# Altium schematic sheet ATmega324PB_Xplained_Pro_dual_input_power_supply.SchDoc: Power supply
size A3; Organization: ATMEL Norway; Address1: Vestre Rosten 79; Address2: N-7075 TILLER; Address3: NORWAY; DocumentNumber: A09-2419; Revision: 2; SheetNumber: 2; SheetTotal: 5; PageSetup: Record=PageOptions|CenterHorizontal=True|CenterVertical=True|PrintScale=1.01|XCorrection=1.00|YCorrection=1.00|PrintKind=1|BorderSize=5000000|LeftOffset=0|BottomOffset=0|Orientation=2|PaperLength=1000|PaperWidth=1000|Scale=100|PaperSource=7|PrintQuality=-4|MediaType=1|DitherType=10|PaperKind=A3 (297 x 420 mm)|PrintScaleMode=1
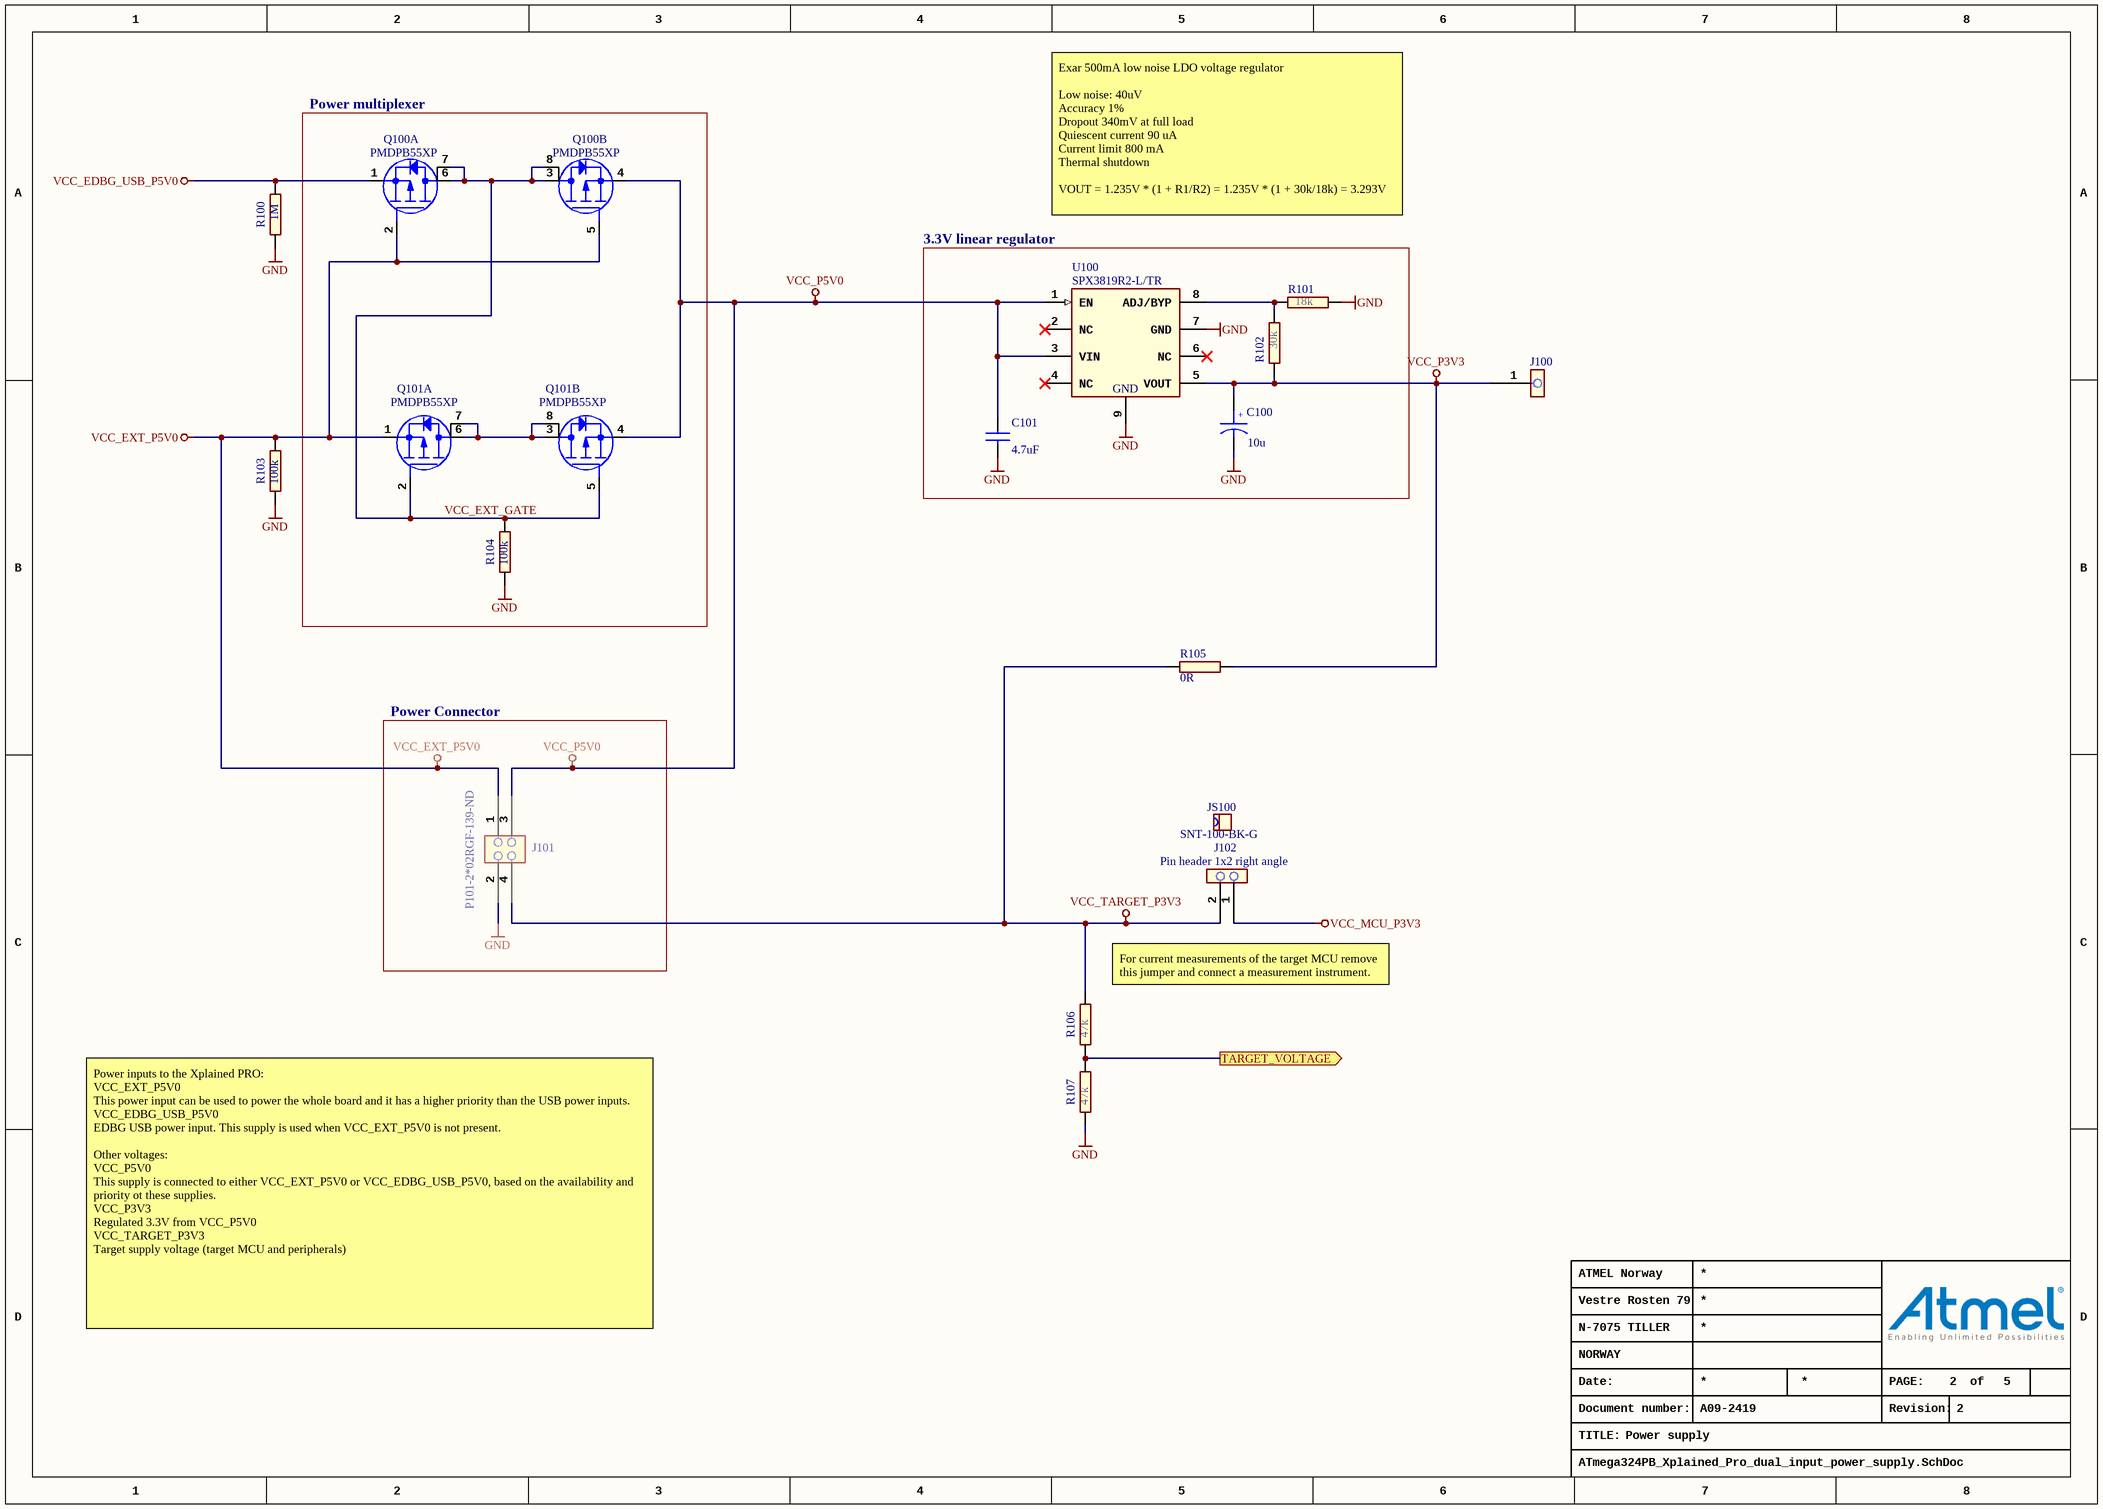
[diagram p0: ATmega324PB_Xplained_Pro_dual_input_power_supply.SchDoc]

## Parts
C100  value 10u  [AP1-00036]
C101  value 4.7uF  [AP1-00039]
J100  (no value)  [AP8-00976]
J101  value P101-2*02RGF-139-ND  [AP8-00628]
J102  value Pin header 1x2 right angle  [AP8-00367]
JS100  value SNT-100-BK-G  [AP8-00525]
Q100  value PMDPB55XP  [AP5-00047]  (hidden comment: Farnell order code: 2191806)  (parts A,B of 2)
Q101  value PMDPB55XP  [AP5-00047]  (hidden comment: Farnell order code: 2191806)  (parts A,B of 2)
R100  value 1M  [AP2-00000]
R101  value 18k  [AP2-00000]
R102  value 30k  [AP2-00000]
R103  value 100k  [AP2-00000]
R104  value 100k  [AP2-00000]
R105  value 0R  [AP2-00000]
R106  value 47k  [AP2-00000]
R107  value 47k  [AP2-00000]
U100  value SPX3819R2-L/TR  [AP6-00338]  (hidden comment: DigiKey: 1016-1588-2-ND)

## Blocks framed on the sheet
Power multiplexer: Q100 Q101 R104
3.3V linear regulator: C100 C101 R101 R102 U100
Power Connector: J101

## Ports
TARGET_VOLTAGE (out)

## Nets
GND: C100.2 C101.2 J101.2 R100.1 R101.2 R103.1 R104.1 R107.1 U100.7(GND) U100.9(GND)
VCC_EDBG_USB_P5V0: Q100.1(S1) R100.2
VCC_EXT_P5V0: J101.1 Q100.2(G1) Q100.5(G2) Q101.1(S1) R103.2
VCC_MCU_P3V3: J102.1
VCC_P3V3: C100.1 J100.1 R102.1 R105.2 U100.5(VOUT)
VCC_P5V0: C101.1 J101.3 Q100.4(S2) Q101.4(S2) U100.1(EN) U100.3(VIN)
VCC_TARGET_P3V3: J101.4 J102.2 R105.1 R106.2
TARGET_VOLTAGE: R106.1 R107.2 ; port TARGET_VOLTAGE
VCC_EXT_GATE: Q100.3(D2) Q100.6(D1) Q100.7(D1_PAD) Q100.8(D2_PAD) Q101.2(G1) Q101.5(G2) R104.2
NetQ101_3: Q101.3(D2) Q101.6(D1) Q101.7(D1_PAD) Q101.8(D2_PAD)
NetR101_1: R101.1 R102.2 U100.8(ADJ/BYP)

Not connected (* = marked no-connect by the designer): U100 2(NC)* 4(NC)* 6(NC)*

## Notes on the sheet
- Exar 500mA low noise LDO voltage regulator
  Low noise: 40uV
  Accuracy 1%
  Dropout 340mV at full load
  Quiescent current 90 uA
  Current limit 800 mA
  Thermal shutdown
  VOUT = 1.235V * (1 + R1/R2) = 1.235V * (1 + 30k/18k) = 3.293V
- (near R106) For current measurements of the target MCU remove this jumper and connect a measurement instrument.
- Power inputs to the Xplained PRO:
  VCC_EXT_P5V0
  This power input can be used to power the whole board and it has a higher priority than the USB power inputs.
  VCC_EDBG_USB_P5V0
  EDBG USB power input. This supply is used when VCC_EXT_P5V0 is not present.
  Other voltages:
  VCC_P5V0
  This supply is connected to either VCC_EXT_P5V0 or VCC_EDBG_USB_P5V0, based on the availability and priority ot these supplies.
  VCC_P3V3
  Regulated 3.3V from VCC_P5V0
  VCC_TARGET_P3V3
  Target supply voltage (target MCU and peripherals)
- Date:
- PAGE:
- of
- TITLE:
- Document number:
- Revision:
- (in symbol A01-0324) +

## Library data of the parts
C100 = A01-0324: SMD tantalum capacitor, ESR = 1.7, 3216-18 (EIA) 1206,; PartGroup: Capacitors,Tantalum; Manufacturer: vishay; MPN: TR3A106K016C1700; Tolerance: +-10%; TemperatureRange: -55°C ~ 85°C; AN: A01-0324; Height: 1,60000002384186
C101 = A01-0377: Ceramic capacitor, SMD 0603, X5R, 10V, 10% (de31036); PartGroup: Capacitors,Ceramic,SMD 0603; Manufacturer: tdk; MPN: C1608X5R1A475K; TemperatureRange: -55 - +85 deg C; AN: A01-0377; Tolerance: 10%; Height: 0,800000011920929
J100 = A08-2457: 1x1 pin header, 2.54mm pitch, Pin-in-Paste THM; PartGroup: Mechanical devices,Connectors,Pin headers; Manufacturer: SAMTEC; Value: HMTSW-101-23-F-S-237; TemperatureRange: - 55 deg C to + 125 deg C; AN: A08-2457; Height: 6,09999990463257; MPN: HMTSW-101-23-F-S-237
J101 = A08-1519: Pin header, 2x2, Right Angle, 2.54mm, THT, Pin In Paste; PartGroup: Mechanical devices,Connectors,Pin headers; Manufacturer: Pro-data International Corp; AN: A08-1519; Height: 5,07999992370605; MPN: P101-2*02RGF-139-ND
J102 = A08-0764: 1x2 pin header, right angle, 2.54 mm pitch, through-hole; PartGroup: Mechanical devices,Connectors,Pin headers; Manufacturer: Pro-data International Corp; MPN: 2213R-2G; AN: A08-0764; Height: 2,53999996185303
JS100 = A08-0543: Jumper cap for 2.54mm pinheader; PartGroup: Mechanical devices,Mounting accessories,Other; Manufacturer: SAMTEC; AN: A08-0543; MPN: SNT-100-BK-G
Q100 Q101 = A05-0146: Dual P-Channel MOSFET, -20V, RDS(ON) < 55 mOhm @-3.4A@-4.5V; PartGroup: Transistors,Power FET,SMD; Manufacturer: NXP; TemperatureRange: -55Â°C to 150Â°C; AN: A05-0146; Height: 0,649999976158142; MPN: PMDPB55XP
R100 = A02-0284: Thick film resistor, SMD 0402, 1/16W, 1%; PartGroup: Resistors,SMD,0402 1%; TemperatureRange: -55 - +125 deg C; AN: A02-0284; Tolerance: 1 %; Height: 0,349999994039536
R101 = A02-0242: Thick film resistor, SMD 0402, 1/16W, 1%; PartGroup: Resistors,SMD,0402 1%; TemperatureRange: -55ï¿½ to +155ï¿½C; AN: A02-0242; Tolerance: 1 %; Height: 0,349999994039536
R102 = A02-0247: Thick film resistor, SMD 0402, 1/16W, 1%; PartGroup: Resistors,SMD,0402 1%; TemperatureRange: -55ï¿½ to +155ï¿½C; AN: A02-0247; Tolerance: 1 %; Height: 0,349999994039536
R103 R104 = A02-0260: Thick film resistor, SMD 0402, 1/16W, 1%; PartGroup: Resistors,SMD,0402 1%; TemperatureRange: -55ï¿½ to +125ï¿½C; AN: A02-0260; Tolerance: 1 %; Height: 0,349999994039536
R105 = A02-0163: RES 0.0 OHM 1/16W 0402 SMD; PartGroup: Resistors,SMD,0402 1%; Manufacturer: (n/a); MPN: RMCF0402ZT0R00; Tolerance: 1 %; TemperatureRange: -55 - +125 deg C; AN: A02-0163; Height: 0,349999994039536
R106 R107 = A02-0252: Thick film resistor, SMD 0402, 1/16W, 1%; PartGroup: Resistors,SMD,0402 1%; TemperatureRange: -55 - +125 deg C; AN: A02-0252; Tolerance: 1 %; Height: 0,349999994039536
U100 = A06-0957: 500mA LDO, ADJ, low noise, 8-DFN package; PartGroup: Integrated Circuits,Regulators,Linear; Manufacturer: Exar; Tolerance: ±1%; TemperatureRange: -40°C to +125°C; AN: A06-0957; Height: 1; MPN: SPX3819R2-L/TR